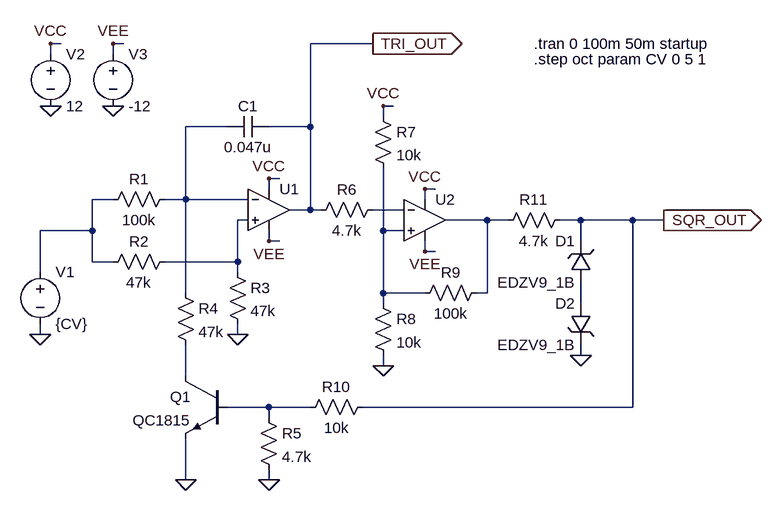
[diagram p0: schematic VCO_VCO.asc]
VCO_VCO.asc, the LTspice schematic file:
Version 4
SHEET 1 1200 680
WIRE -80 -128 -96 -128
WIRE 16 -128 0 -128
WIRE 400 -128 304 -128
WIRE -96 -112 -96 -128
WIRE 0 -112 0 -128
WIRE 432 -32 416 -32
WIRE 416 -16 416 -32
WIRE 176 0 112 0
WIRE 304 0 304 -128
WIRE 304 0 240 0
WIRE 256 80 240 80
WIRE 240 96 240 80
WIRE 496 96 480 96
WIRE 0 112 -32 112
WIRE 112 112 112 0
WIRE 112 112 80 112
WIRE 208 112 112 112
WIRE 480 112 480 96
WIRE 304 128 304 0
WIRE 304 128 272 128
WIRE 320 128 304 128
WIRE 448 128 400 128
WIRE 208 144 192 144
WIRE 576 144 512 144
WIRE 608 144 576 144
WIRE 720 144 688 144
WIRE 800 144 720 144
WIRE 848 144 800 144
WIRE -32 160 -32 112
WIRE -32 160 -112 160
WIRE 416 160 416 64
WIRE 448 160 416 160
WIRE 240 176 240 160
WIRE 256 176 240 176
WIRE 720 176 720 144
WIRE 480 192 480 176
WIRE 496 192 480 192
WIRE -32 208 -32 160
WIRE 0 208 -32 208
WIRE 192 208 192 144
WIRE 192 208 80 208
WIRE -112 224 -112 160
WIRE 192 224 192 208
WIRE 112 256 112 112
WIRE 416 256 416 160
WIRE 480 256 416 256
WIRE 576 256 576 144
WIRE 576 256 560 256
WIRE 416 272 416 256
WIRE 720 272 720 240
WIRE -112 320 -112 304
WIRE 192 320 192 304
WIRE 720 352 720 336
WIRE 416 368 416 352
WIRE 112 384 112 336
WIRE 240 432 176 432
WIRE 304 432 240 432
WIRE 800 432 800 144
WIRE 800 432 384 432
WIRE 240 448 240 432
WIRE 112 544 112 480
WIRE 240 544 240 528
FLAG 240 80 VCC
FLAG 240 176 VEE
FLAG 192 320 0
FLAG 112 544 0
FLAG 240 544 0
FLAG 480 96 VCC
FLAG 480 192 VEE
FLAG 416 -32 VCC
FLAG 416 368 0
FLAG 848 144 SQR_OUT
IOPIN 848 144 Out
FLAG 720 352 0
FLAG -112 320 0
FLAG -96 -32 0
FLAG 0 -32 0
FLAG -96 -128 VCC
FLAG 0 -128 VEE
FLAG 400 -128 TRI_OUT
IOPIN 400 -128 Out
SYMBOL Opamps\\UniversalOpamp2 240 128 R0
SYMATTR InstName U1
SYMBOL Opamps\\UniversalOpamp2 480 144 R0
SYMATTR InstName U2
SYMBOL res 96 96 R90
WINDOW 0 0 56 VBottom 2
WINDOW 3 32 56 VTop 2
SYMATTR InstName R1
SYMATTR Value 100k
SYMBOL res 96 192 R90
WINDOW 0 0 56 VBottom 2
WINDOW 3 32 56 VTop 2
SYMATTR InstName R2
SYMATTR Value 47k
SYMBOL res 176 208 R0
SYMATTR InstName R3
SYMATTR Value 47k
SYMBOL cap 240 -16 R90
WINDOW 0 0 32 VBottom 2
WINDOW 3 32 32 VTop 2
SYMATTR InstName C1
SYMATTR Value 0.047u
SYMBOL npn 176 384 M0
SYMATTR InstName Q1
SYMATTR Value QC1815
SYMBOL res 96 240 R0
SYMATTR InstName R4
SYMATTR Value 47k
SYMBOL res 224 432 R0
SYMATTR InstName R5
SYMATTR Value 4.7k
SYMBOL res 416 112 R90
WINDOW 0 0 56 VBottom 2
WINDOW 3 32 56 VTop 2
SYMATTR InstName R6
SYMATTR Value 4.7k
SYMBOL res 400 -32 R0
SYMATTR InstName R7
SYMATTR Value 10k
SYMBOL res 400 256 R0
SYMATTR InstName R8
SYMATTR Value 10k
SYMBOL res 576 240 R90
WINDOW 0 0 56 VBottom 2
WINDOW 3 32 56 VTop 2
SYMATTR InstName R9
SYMATTR Value 100k
SYMBOL res 400 416 R90
WINDOW 0 0 56 VBottom 2
WINDOW 3 32 56 VTop 2
SYMATTR InstName R10
SYMATTR Value 10k
SYMBOL res 704 128 R90
WINDOW 0 0 56 VBottom 2
WINDOW 3 32 56 VTop 2
SYMATTR InstName R11
SYMATTR Value 4.7k
SYMBOL zener 736 240 R180
WINDOW 0 24 64 Left 2
WINDOW 3 24 0 Left 2
SYMATTR InstName D1
SYMATTR Value EDZV9_1B
SYMBOL zener 736 272 M0
SYMATTR InstName D2
SYMATTR Value EDZV9_1B
SYMBOL voltage -112 208 R0
WINDOW 123 0 0 Left 2
WINDOW 39 0 0 Left 2
SYMATTR InstName V1
SYMATTR Value {CV}
SYMBOL voltage -96 -128 R0
WINDOW 123 0 0 Left 2
WINDOW 39 0 0 Left 2
SYMATTR InstName V2
SYMATTR Value 12
SYMBOL voltage 0 -128 R0
WINDOW 123 0 0 Left 2
WINDOW 39 0 0 Left 2
SYMATTR InstName V3
SYMATTR Value -12
TEXT 648 -128 Left 2 !.tran 0 100m 50m startup
TEXT 648 -104 Left 2 !.step oct param CV 0 5 1

The netlist it stands for:
* VCO_VCO.asc
XU1 N004 N001 VCC VEE TRI_OUT level.2 Avol=1Meg GBW=10Meg Slew=10Meg ilimit=25m rail=0 Vos=0 phimargin=45 en=0 enk=0 in=0 ink=0 Rin=500Meg  ; pins IN+ IN- V+ V- OUT
XU2 N006 N003 VCC VEE N005 level.2 Avol=1Meg GBW=10Meg Slew=10Meg ilimit=25m rail=0 Vos=0 phimargin=45 en=0 enk=0 in=0 ink=0 Rin=500Meg  ; pins IN+ IN- V+ V- OUT
R1 N001 N002 100k
R2 N004 N002 47k
R3 N004 0 47k
C1 TRI_OUT N001 0.047u
Q1 N008 N009 0 0 QC1815
R4 N001 N008 47k
R5 N009 0 4.7k
R6 N003 TRI_OUT 4.7k
R7 VCC N006 10k
R8 N006 0 10k
R9 N005 N006 100k
R10 SQR_OUT N009 10k
R11 SQR_OUT N005 4.7k
D1 N007 SQR_OUT EDZV9_1B
D2 N007 0 EDZV9_1B
V1 N002 0 {CV}
V2 VCC 0 12
V3 VEE 0 -12
.model D D
.lib standard.dio
.model NPN NPN
.model PNP PNP
.lib standard.bjt
.tran 0 100m 50m startup
.step oct param CV 0 5 1
.lib UniversalOpamps2.sub
.backanno
.end